# Altium project PCB_Project1.PrjPCB (part 1 of 3)
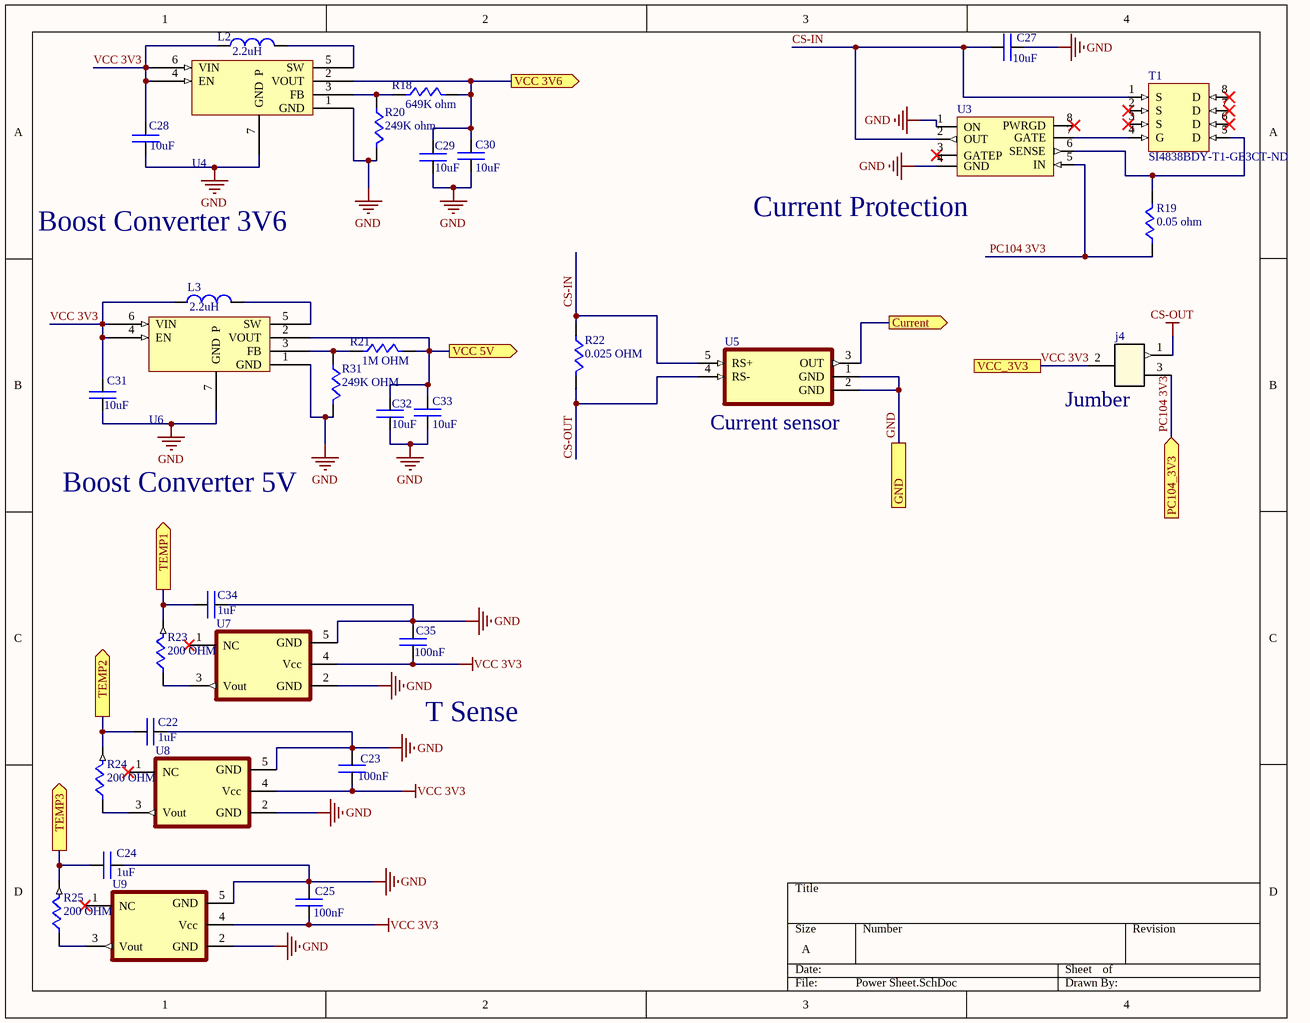
[diagram p0: Power Sheet.SchDoc]
2 sheets, 95 parts. Net scope: flat (ports and power ports of the same name join across sheets).
Board file: CommunicationBoard.PcbDoc
Sheets:
  Power Sheet.SchDoc
  Micro_Conection.SchDoc

## Sheet Power Sheet.SchDoc
size A

### Parts
C22  Capacitance: 1uF  [0805 C]  (hidden comment: CAP CER 1UF 16V X7R 0805)
C23  Capacitance: 100nF  [0805 C]  (hidden comment: CAP CER 0.1UF 10V 0805)
C24  Capacitance: 1uF  [0805 C]  (hidden comment: CAP CER 1UF 16V X7R 0805)
C25  Capacitance: 100nF  [0805 C]  (hidden comment: CAP CER 0.1UF 10V 0805)
C27  Capacitance: 10uF  [0805 C]  (hidden comment: CAP CER 10UF 10V X5R 0805)
C28  Capacitance: 10uF  [0805 C]  (hidden comment: CAP CER 10UF 10V X5R 0805)
C29  Capacitance: 10uF  [0805 C]  (hidden comment: CAP CER 10UF 10V X5R 0805)
C30  Capacitance: 10uF  [0805 C]  (hidden comment: CAP CER 10UF 10V X5R 0805)
C31  Capacitance: 10uF  [0805 C]  (hidden comment: CAP CER 10UF 10V X5R 0805)
C32  Capacitance: 10uF  [0805 C]  (hidden comment: CAP CER 10UF 10V X5R 0805)
C33  Capacitance: 10uF  [0805 C]  (hidden comment: CAP CER 10UF 10V X5R 0805)
C34  Capacitance: 1uF  [0805 C]  (hidden comment: CAP CER 1UF 16V X7R 0805)
C35  Capacitance: 100nF  [0805 C]  (hidden comment: CAP CER 0.1UF 10V 0805)
j4  CONN HEADER VERT 3POS 2.54MM  [jumber]  (value not drawn)
L2  Inductance: 2.2uH  [0805 L]  (hidden comment: FIXED IND 2.2UH 800MA 200 MOHM)
L3  Inductance: 2.2uH  [0805 L]  (hidden comment: FIXED IND 2.2UH 800MA 200 MOHM)
R18  649K ohm  [0805 R]
R19  0.05 ohm  [0805 R]
R20  249K ohm  [0805 R]
R21  1M OHM  [0805 R]
R22  0.025 OHM  [0805 R]
R23  200 OHM  [0805 R]
R24  200 OHM  [0805 R]
R25  200 OHM  [0805 R]
R31  249K OHM  [0805 R]
T1  Supplier Part Number 1: SI4838BDY-T1-GE3CT-ND  [Transistor_MOSFET]  (hidden comment: MOSFET N-CH 12V 34A 8-SOIC)
U3  IC OVERVOLTAGE/CUR PROT TSOT23-8  [current protection]  (value not drawn)
U4  IC REG BOOST 3.6V 800MA 6WSON  [Booster converter]  (value not drawn)
U5  IC CURR SENSE 1 CIRCUIT SOT23-5  [current sensor]  (value not drawn)
U6  IC REG BOOST 3.6V 800MA 6WSON  [Booster converter]  (value not drawn)
U7  SENSOR ANALOG -55C-130C SOT323-5  [temperture sensor]  (value not drawn)
U8  SENSOR ANALOG -55C-130C SOT323-5  [temperture sensor]  (value not drawn)
U9  SENSOR ANALOG -55C-130C SOT323-5  [temperture sensor]  (value not drawn)

### Ports
Current (out), GND, PC104_3V3 (in), TEMP1 (out), TEMP2 (out), TEMP3 (out), VCC 3V6 (out), VCC 5V (out), VCC_3V3

### Nets
CS-OUT: j4.1 R22.1 U5.4(RS-)
GND: C22.2 C23.1 C24.2 C25.1 C27.1 C28.2 C29.1 C30.1 C31.2 C32.1 C33.1 C34.2 C35.1 R20.1 R31.1 U3.1(ON) U3.4(GND) U4.1(GND) U4.7(GND__P) U5.1(GND) U5.2(GND) U6.1(GND) U6.7(GND__P) U7.2(GND) U7.5(GND) U8.2(GND) U8.5(GND) U9.2(GND) U9.5(GND) ; port GND
VCC 3V3: C23.2 C25.2 C28.1 C31.1 C35.2 j4.2 L2.2 L3.2 U4.4(EN) U4.6(VIN) U6.4(EN) U6.6(VIN) U7.4(Vcc) U8.4(Vcc) U9.4(Vcc) ; port VCC_3V3
CS-IN: C27.2 R22.2 T1.1(S) U3.2(OUT) U5.5(RS+)
PC104 3V3: j4.3 R19.2 U3.5(IN) ; port PC104_3V3
NetC22_1: C22.1 R24.1 ; port TEMP2
NetC24_1: C24.1 R25.1 ; port TEMP3
NetC29_2: C29.2 C30.2 R18.1 U4.2(VOUT) ; port VCC 3V6
NetC32_2: C32.2 C33.2 R21.1 U6.2(VOUT) ; port VCC 5V
NetC34_1: C34.1 R23.1 ; port TEMP1
NetL2_1: L2.1 U4.5(SW)
NetL3_1: L3.1 U6.5(SW)
NetR18_2: R18.2 R20.2 U4.3(FB)
NetR19_1: R19.1 T1.5(D) U3.6(SENSE)
NetR21_2: R21.2 R31.2 U6.3(FB)
NetR23_2: R23.2 U7.3(Vout)
NetR24_2: R24.2 U8.3(Vout)
NetR25_2: R25.2 U9.3(Vout)
NetT1_4: T1.4(G) U3.7(GATE)
NetU1_26: U5.3(OUT) ; port Current

Not connected (* = marked no-connect by the designer): T1 2(S)* 3(S)* 6(D)* 7(D)* 8(D)*; U3 3(GATEP)* 8(PWRGD)*; U7 1(NC)*; U8 1(NC)*; U9 1(NC)*

### Notes on the sheet
- Boost Converter 3V6
- (near U3) Current Protection
- (near U5) Current sensor
- (near j4) Jumber
- Boost Converter 5V
- T Sense

### Library data of the parts
C22 C24 C34 = C_1uF: 1µF ±5% 16V Ceramic Capacitor X7R 0805 (2012 Metric); Manufacturer: Murata; Manufacturer Part Number: GRM219R61H105KA73D; Tolerance: 10%; Voltage Rating: 50V; Dielectric: X5R; Dissipation Factor: 0.025%; Supplier 1: Digi-Key; RoHS: Yes; Stock 1: 54905; Pricing 1: 1 = 0.38000, 10 = 0.26100, 50 = 0.17420, 100 = 0.14810, 500 = 0.10454, 1000 = 0.09148 (USD); Mount: Surface Mount; Case/Package: 0805; Number of Pins: 2; Case Code (Metric): 2012; Case Code (Imperial): 0805; Material: Ceramic; Weight: 0.000335oz; Dielectric Material: Ceramic; Min Operating Temperature: -55°C; Max Operating Temperature: 85°C; Packaging: Tape and Reel; Voltage: 50V; Termination: SMD/SMT; Resistor Type: Ceramic; Voltage Rating (DC): 50V; Package Quantity: 4000; Length: 2mm; Width: 1.25mm; Height: 0.85mm; Thickness: 0.037inch; Depth: 1.25mm; REACH SVHC: No SVHC; Lead Free: Lead Free; ComponentLink1URL: http://www.farnell.com/datasheets/2746093.pdf?src-supplier=Farnell; ComponentLink1Description: http://www.farnell.com/datasheets/2746093.pdf?src-supplier=Farnell; Supplier Part Number 1: 399-8001-1-ND; Features: Soft Termination; Ratings: AEC-Q200; Radiation Hardening: No; Series: C; Construction: Flat; Lead Pitch: 0.75mm; RoHS Compliant: Yes
C23 C25 C35 = C_100nF: 0.1µF ±10% 16V Ceramic Capacitor X7R 0805 (2012 Metric); Manufacturer: Johanson; Manufacturer Part Number: 160R15W104KV4T; Supplier 1: Digi-Key; RoHS: Yes; Stock 1: 45779; Pricing 1: 1 = 0.21000, 10 = 0.14200, 50 = 0.08520, 100 = 0.07190, 500 = 0.04920, 1000 = 0.04352 (USD); Mount: Surface Mount; Case/Package: 0805; Case Code (Imperial): 0805; Case Code (Metric): 2012; Min Operating Temperature: -55°C; Max Operating Temperature: 125°C; Tolerance: 10%; Packaging: Tape and Reel; Voltage Rating: 16V; Dielectric: X7R; Termination: SMD/SMT; Voltage Rating (DC): 16V; Package Quantity: 1; Length: 0.08inch; Width: 0.05inch; Thickness: 0.05inch; ComponentLink1URL: https://www.johansondielectrics.com/downloads/catalog/johanson-dielectrics-product-catalog.pdf; ComponentLink1Description: https://www.johansondielectrics.com/downloads/catalog/johanson-dielectrics-product-catalog.pdf; Supplier Part Number 1: 709-1183-1-ND; Series: -; RoHS Compliant: Yes
C27-C33 = C_10uF: 10µF ±10% 10V Ceramic Capacitor X5R 0805 (2012 Metric); Manufacturer: TDK; Manufacturer Part Number: C2012X5R1C106K085AC; Voltage Rating: 16V; Supplier 1: Digi-Key; RoHS: Yes; Stock 1: 2246101; Pricing 1: 1 = 0.13000, 10 = 0.09100, 50 = 0.05160, 100 = 0.04270, 500 = 0.02992, 1000 = 0.02478 (USD); Mount: Surface Mount; Case/Package: 0805; Number of Pins: 2; Weight: 0.000194oz; Dielectric Material: Ceramic; Case Code (Metric): 2012; Case Code (Imperial): 0805; Min Operating Temperature: -55°C; Max Operating Temperature: 85°C; Tolerance: 10%; Packaging: Tape and Reel; Voltage Rating (DC): 16V; Package Quantity: 1; Termination: SMD/SMT; Resistor Type: Ceramic; Dielectric: X5R; Length: 2mm; Width: 0.049inch; Height: 0.85mm; Thickness: 0.037inch; Depth: 1.25mm; REACH SVHC: No SVHC; Lead Free: Lead Free; ComponentLink1URL: https://datasheet.ciiva.com/25730/cl21a106kpclqnc-25730594.pdf?src-supplier=Digi-Key; ComponentLink1Description: https://datasheet.ciiva.com/25730/cl21a106kpclqnc-25730594.pdf?src-supplier=Digi-Key; Supplier Part Number 1: 1276-2402-1-ND; Contact Plating: Tin; Series: CL; Construction: Flat; Radiation Hardening: No; RoHS Compliant: Yes
j4 = jumber: Connector Header Through Hole 3 position 0.100" (2.54mm); Manufacturer: Harwin; Manufacturer Part Number: M20-9990345; Contact Resistance: 25mR; Max Current Rating: 3A; Number of Positions: 3; Connector Type: Male Pin; Insulation Resistance: 10GR; Voltage Rating (AC): 750V; Gender: Male; Supplier 1: Digi-Key; Supplier Part Number 1: 732-5316-ND; RoHS: Yes; Mount: Through Hole; Case/Package: SIL; Contact Material: Brass,Bronze; Color: Black; Housing Color: Black; Housing Material: Nylon; Contact Plating: Gold; Weight: 0.006138oz; Min Operating Temperature: -40°C; Max Operating Temperature: 105°C; Number of Rows: 1; Package Quantity: 1000; Packaging: Bulk; Termination: Solder; Number of Contacts: 3; Orientation: Straight; Current Rating: 3A; Series: M20; Contact Type: Male Pin; Length: 7.62mm; Width: 0.25inch; Height: 0.125inch; Pitch: 2.54mm; Depth: 2.54mm; Contact Mating Length: 0.24inch; Radiation Hardening: No; REACH SVHC: No SVHC; RoHS Compliant: Yes; Stock 1: 36526; Pricing 1: 1 = 0.13000, 10 = 0.10600, 25 = 0.08800, 50 = 0.07400, 100 = 0.06700, 1000 = 0.06100 (USD); Lead Free: Lead Free; ComponentLink1URL: http://www.farnell.com/cad/1737268.pdf?src-supplier=Element14; ComponentLink1Description: http://www.farnell.com/cad/1737268.pdf?src-supplier=Element14; ComponentLink2URL: https://katalog.we-online.de/em/datasheet/6130xx11121.pdf?src-supplier=Digi-Key; ComponentLink2Description: https://katalog.we-online.de/em/datasheet/6130xx11121.pdf?src-supplier=Digi-Key
L2 L3 = L _2.2 uh: 2.2µH Shielded Multilayer Inductor 800mA 200mOhm Max 0805 (2012 Metric); Manufacturer: Taiyo Yuden; Manufacturer Part Number: BRC2012T2R2MD; Core Material: Ferrite; Max DC Current: 1A; DC Resistance (DCR): 143mR; Tolerance: 20%; Test Frequency: 1MHz; Self Resonant Frequency: 350MHz; Shielding: Unshielded; Saturation Current: 1.1A; RoHS: Yes; Mount: Surface Mount; Case/Package: 0805; Case Code (Imperial): 0805; Case Code (Metric): 2012; Min Operating Temperature: -40°C; Max Operating Temperature: 105°C; Termination: SMD/SMT; Resistor Type: Wirewound; DC Current: 1A; Packaging: Tape and Reel; Package Quantity: 2000; Current Rating: 1A; Length: 2mm; Height: 1.4mm; Depth: 1.45mm; Width: 0.049inch; Radiation Hardening: No; Military Standard: Not; Lead Free: Lead Free; Inductance Tolerance: 20%; Height - Seated (Max): 0.055inch; REACH SVHC: Unknown; Series: BRC; Supplier 1: Digi-Key; Stock 1: 117383; Pricing 1: 1 = 0.30000, 10 = 0.26800, 25 = 0.23440, 50 = 0.20100, 100 = 0.18420, 250 = 0.16752, 500 = 0.15744, 1000 = 0.12060 (USD); Supplier Part Number 1: 587-2905-1-ND; Number of Pins: 2; Lead Pitch: 1mm; Halogen Free: Halogen Free; RoHS Compliant: Yes; ComponentLink1URL: https://datasheet.ciiva.com/6748/brc2012t2r2md-ss-6748784.pdf?src-supplier=Newark; ComponentLink1Description: https://datasheet.ciiva.com/6748/brc2012t2r2md-ss-6748784.pdf?src-supplier=Newark; ComponentLink2URL: https://datasheet.ciiva.com/25607/0900766b810b3c54-25607837.pdf?src-supplier=RSComponents; ComponentLink2Description: https://datasheet.ciiva.com/25607/0900766b810b3c54-25607837.pdf?src-supplier=RSComponents; ComponentLink3URL: https://datasheet.ciiva.com/26870/getdatasheetpartid-639072-26870958.pdf?src-supplier=Verical; ComponentLink3Description: https://datasheet.ciiva.com/26870/getdatasheetpartid-639072-26870958.pdf?src-supplier=Verical; ComponentLink4URL: https://datasheet.ciiva.com/1042/wound07-e-1042306.pdf?src-supplier=Digi-Key; ComponentLink4Description: https://datasheet.ciiva.com/1042/wound07-e-1042306.pdf?src-supplier=Digi-Key; ComponentLink5URL: https://datasheet.ciiva.com/1042/wound07-e-1042307.pdf?src-supplier=Digi-Key; ComponentLink5Description: https://datasheet.ciiva.com/1042/wound07-e-1042307.pdf?src-supplier=Digi-Key; ComponentLink6URL: https://datasheet.ciiva.com/1042/wound07-e-1042308.pdf?src-supplier=Digi-Key; ComponentLink6Description: https://datasheet.ciiva.com/1042/wound07-e-1042308.pdf?src-supplier=Digi-Key
R18 = R_649k ohm: 649 kOhms ±0.5% 0.25W, 1/4W Chip Resistor 0805 (2012 Metric) Automotive AEC-Q200, Pulse Withstanding Thick Film; Manufacturer: Vishay; Manufacturer Part Number: CRCW08050000Z0EAC; Power Rating: 125mW; Resistance: 20R; Max Power Dissipation: 250mW; Temperature Coefficient: 50ppm/°C; RoHS: Yes; Mount: Surface Mount; Case/Package: Molded; Contact Plating: Tin; Min Operating Temperature: -55°C; Max Operating Temperature: 155°C; Resistor Type: Thick Film; Termination: Wraparound; Length: 2mm; Lead Free: Lead Free; ComponentLink1URL: http://www.vishay.com/docs/28773/crcwce3.pdf?src-supplier=Digi-Key; ComponentLink1Description: http://www.vishay.com/docs/28773/crcwce3.pdf?src-supplier=Digi-Key; Supplier 1: Digi-Key; Stock 1: 4016; Pricing 1: 1 = 0.23000, 10 = 0.19100, 25 = 0.13920, 50 = 0.10100, 100 = 0.07480, 250 = 0.05744, 500 = 0.04524, 1000 = 0.03132 (USD); Case Code (Imperial): 0805; Case Code (Metric): 2012; Tolerance: 0.5%; Packaging: Tape and Reel; Number of Terminations: 2; Features: Automotive AEC-Q200; Width: 0.049inch; Height - Seated (Max): 0.028inch; ComponentLink2URL: https://industrial.panasonic.com/sa/system/files/data/download/catalog/id_fixed-resistors_e_2.pdf?src-supplier=Digi-Key; ComponentLink2Description: https://industrial.panasonic.com/sa/system/files/data/download/catalog/id_fixed-resistors_e_2.pdf?src-supplier=Digi-Key; Supplier Part Number 1: P21340CT-ND
R19 = R_0.05ohm: 50 mOhms ±1% 0.5W, 1/2W Chip Resistor 0805 (2012 Metric) Automotive AEC-Q200, Current Sense Thick Film; Manufacturer: Vishay; Manufacturer Part Number: CRCW08050000Z0EAC; Power Rating: 125mW; Resistance: 20R; Temperature Coefficient: 100ppm/°C; RoHS: Yes; Mount: Surface Mount; Case/Package: Molded; Contact Plating: Tin; Min Operating Temperature: -55°C; Max Operating Temperature: 155°C; Resistor Type: Thick Film; Termination: Wraparound; Length: 2mm; Lead Free: Lead Free; ComponentLink1URL: http://www.mouser.com/ds/2/315/AOA0000C295-1109214.pdf?src-supplier=Mouser; ComponentLink1Description: http://www.mouser.com/ds/2/315/AOA0000C295-1109214.pdf?src-supplier=Mouser; Supplier 1: Digi-Key; Stock 1: 4506; Pricing 1: 1 = 0.58000, 10 = 0.42500, 100 = 0.24750, 1000 = 0.13880, 2500 = 0.13600 (USD); Number of Pins: 2; Case Code (Metric): 2012; Case Code (Imperial): 0805; Weight: 0.000194oz; Tolerance: 1%; Packaging: Tape and Reel; Package Quantity: 5000; Number of Terminations: 2; Max Power Dissipation: 125mW; Width: 0.049inch; Height: 0.6mm; Depth: 1.25mm; Radiation Hardening: No; REACH SVHC: No SVHC; Military Standard: Not; ComponentLink2URL: http://www.farnell.com/datasheets/2244535.pdf?src-supplier=Farnell; ComponentLink2Description: http://www.farnell.com/datasheets/2244535.pdf?src-supplier=Farnell; ComponentLink3URL: https://industrial.panasonic.com/cdbs/www-data/pdf/RDN0000/AOA0000C313.pdf?src-supplier=Digi-Key; ComponentLink3Description: https://industrial.panasonic.com/cdbs/www-data/pdf/RDN0000/AOA0000C313.pdf?src-supplier=Digi-Key; ComponentLink4URL: http://www.farnell.com/datasheets/2244535.pdf?src-supplier=Newark; ComponentLink4Description: http://www.farnell.com/datasheets/2244535.pdf?src-supplier=Newark; ComponentLink5URL: http://www.farnell.com/datasheets/1951809.pdf?src-supplier=Element14; ComponentLink5Description: http://www.farnell.com/datasheets/1951809.pdf?src-supplier=Element14; Supplier Part Number 1: P17581CT-ND; Features: Automotive AEC-Q200
R20 R31 = R_249 kohm: 249 kOhms ±1% 0.5W, 1/2W Chip Resistor 0805 (2012 Metric) Automotive AEC-Q200, Pulse Withstanding Thick Film; Manufacturer: Vishay Dale; Manufacturer Part Number: CRCW0805249KFKEAHP; Power Rating: 330mW; Resistance: 249kR; Max Power Dissipation: 500mW; Temperature Coefficient: 100ppm/°C; RoHS: Yes; Mount: Surface Mount; Case/Package: 0805; Contact Plating: Tin; Min Operating Temperature: -55°C; Max Operating Temperature: 155°C; Resistor Type: Thick Film; Termination: Wraparound; Length: 0.079inch; Lead Free: Lead Free; ComponentLink1URL: http://www.vishay.com/docs/28773/crcwce3.pdf?src-supplier=Digi-Key; ComponentLink1Description: http://www.vishay.com/docs/28773/crcwce3.pdf?src-supplier=Digi-Key; Supplier 1: Digi-Key; Stock 1: 4200; Pricing 1: 1 = 0.23000, 10 = 0.19200, 100 = 0.07520, 1000 = 0.03150, 2500 = 0.02888 (USD); Package Quantity: 5000; Tolerance: 1%; Packaging: Tape and Reel; Number of Terminations: 2; Features: Automotive AEC-Q200; Series: CRCW-HP; Width: 0.049inch; Height: 0.024inch; RoHS Compliant: Yes; ComponentLink2URL: https://datasheet.ciiva.com/2581/crcwhpe3-2581775.pdf?src-supplier=Digi-Key; ComponentLink2Description: https://datasheet.ciiva.com/2581/crcwhpe3-2581775.pdf?src-supplier=Digi-Key; Supplier Part Number 1: 541-CRCW0805249KFKEAHPCT-ND
R21 = R_1 Mohm: 1 MOhms ±1% 0.5W, 1/2W Chip Resistor 0805 (2012 Metric) Automotive AEC-Q200, Pulse Withstanding Thick Film; Manufacturer: Vishay; Manufacturer Part Number: CRCW08050000Z0EAC; Power Rating: 125mW; Resistance: 20R; Voltage Rating: 150V; Max Power Dissipation: 333mW; Temperature Coefficient: 100ppm/°C; RoHS: Yes; Mount: Surface Mount; Case/Package: Molded; Contact Plating: Tin; Min Operating Temperature: -55°C; Max Operating Temperature: 155°C; Resistor Type: Thick Film; Termination: Wraparound; Length: 2mm; Lead Free: Lead Free; ComponentLink1URL: http://www.vishay.com/docs/28773/crcwce3.pdf?src-supplier=Digi-Key; ComponentLink1Description: http://www.vishay.com/docs/28773/crcwce3.pdf?src-supplier=Digi-Key; Supplier 1: Digi-Key; Stock 1: 21204; Pricing 1: 1 = 0.23000, 10 = 0.19300, 100 = 0.07530, 1000 = 0.03150, 2500 = 0.02888 (USD); Weight: 0.000194oz; Case Code (Metric): 2012; Case Code (Imperial): 0805; Package Quantity: 10; Tolerance: 1%; Packaging: Tape and Reel; Number of Terminations: 2; Features: Automotive AEC-Q200; Series: CRCW-HP; Width: 0.049inch; Height: 0.024inch; Radiation Hardening: No; RoHS Compliant: Yes; ComponentLink2URL: https://datasheet.ciiva.com/2475/crcwhpe3-2475641.pdf?src-supplier=Digi-Key; ComponentLink2Description: https://datasheet.ciiva.com/2475/crcwhpe3-2475641.pdf?src-supplier=Digi-Key; ComponentLink3URL: https://datasheet.ciiva.com/2475/crcwhpe3-2475642.pdf?src-supplier=Digi-Key; ComponentLink3Description: https://datasheet.ciiva.com/2475/crcwhpe3-2475642.pdf?src-supplier=Digi-Key; ComponentLink4URL: https://datasheet.ciiva.com/2475/crcwhpe3-2475643.pdf?src-supplier=Digi-Key; ComponentLink4Description: https://datasheet.ciiva.com/2475/crcwhpe3-2475643.pdf?src-supplier=Digi-Key; ComponentLink5URL: https://datasheet.ciiva.com/48527/crcwhpe3-48527597.pdf?src-supplier=Avnet; ComponentLink5Description: https://datasheet.ciiva.com/48527/crcwhpe3-48527597.pdf?src-supplier=Avnet; ComponentLink6URL: https://datasheet.ciiva.com/5545/crcwhpe3-46056-5545486.pdf?src-supplier=Mouser; ComponentLink6Description: https://datasheet.ciiva.com/5545/crcwhpe3-46056-5545486.pdf?src-supplier=Mouser; ComponentLink7URL: https://datasheet.ciiva.com/9112/crcwhpe3-9112399.pdf?src-supplier=Avnet; ComponentLink7Description: https://datasheet.ciiva.com/9112/crcwhpe3-9112399.pdf?src-supplier=Avnet; Supplier Part Number 1: 541-1.00MTCT-ND
R22 = R_0.025ohm: 25 mOhms ±1% 0.5W, 1/2W Chip Resistor 0805 (2012 Metric) Automotive AEC-Q200, Current Sense Thick Film; Manufacturer: Vishay; Manufacturer Part Number: CRCW08050000Z0EAC; RoHS: Yes; Mount: Surface Mount; Case/Package: Molded; ComponentLink1URL: http://www.mouser.com/ds/2/315/AOA0000C295-1109214.pdf?src-supplier=Mouser; ComponentLink1Description: http://www.mouser.com/ds/2/315/AOA0000C295-1109214.pdf?src-supplier=Mouser; ComponentLink2URL: http://www.farnell.com/datasheets/2244535.pdf?src-supplier=Farnell; ComponentLink2Description: http://www.farnell.com/datasheets/2244535.pdf?src-supplier=Farnell; ComponentLink3URL: https://industrial.panasonic.com/cdbs/www-data/pdf/RDN0000/AOA0000C313.pdf?src-supplier=Digi-Key; ComponentLink3Description: https://industrial.panasonic.com/cdbs/www-data/pdf/RDN0000/AOA0000C313.pdf?src-supplier=Digi-Key; ComponentLink4URL: http://www.farnell.com/datasheets/2244535.pdf?src-supplier=Newark; ComponentLink4Description: http://www.farnell.com/datasheets/2244535.pdf?src-supplier=Newark; ComponentLink5URL: http://www.farnell.com/datasheets/1951809.pdf?src-supplier=Element14; ComponentLink5Description: http://www.farnell.com/datasheets/1951809.pdf?src-supplier=Element14; Supplier 1: Future Electronics; Supplier Part Number 1: 6091549
R23-R25 = R_200 ohm: 200 Ohms ±0.1% 0.125W, 1/8W Chip Resistor 0805 (2012 Metric) Automotive AEC-Q200 Thin Film; Manufacturer: Panasonic; Manufacturer Part Number: ERJ-P06F2000V; Temperature Coefficient: 100ppm/°C; Voltage Rating (DC): 150V; Resistance: 200R; Power Rating: 500mW; Tolerance: 1%; Supplier 1: Digi-Key; RoHS: Yes; Stock 1: 15886; Pricing 1: 1 = 0.31000, 10 = 0.26200, 100 = 0.10230, 1000 = 0.04284, 2500 = 0.03927 (USD); Mount: Surface Mount; Case/Package: 0805; Number of Pins: 2; Case Code (Imperial): 0805; Case Code (Metric): 2012; Contact Plating: Tin; Min Operating Temperature: -55°C; Max Operating Temperature: 155°C; Resistor Type: Thick Film; Voltage Rating: 150V; Packaging: Tape and Reel; Package Quantity: 5000; Termination: Wraparound; Length: 2mm; Width: 1.2mm; Height: 0.6mm; Depth: 1.25mm; Lead Free: Lead Free; Military Standard: Not; REACH SVHC: No SVHC; ComponentLink1URL: https://datasheet.ciiva.com/11811/0900766b812cb812-11811594.pdf?src-supplier=RSComponents; ComponentLink1Description: https://datasheet.ciiva.com/11811/0900766b812cb812-11811594.pdf?src-supplier=RSComponents; ComponentLink2URL: https://datasheet.ciiva.com/24026/aoa0000ce4-64075-24026537.pdf?src-supplier=Mouser; ComponentLink2Description: https://datasheet.ciiva.com/24026/aoa0000ce4-64075-24026537.pdf?src-supplier=Mouser; ComponentLink3URL: https://datasheet.ciiva.com/9184/aoa0000ce4-9184694.pdf?src-supplier=Avnet; ComponentLink3Description: https://datasheet.ciiva.com/9184/aoa0000ce4-9184694.pdf?src-supplier=Avnet; ComponentLink4URL: https://datasheet.ciiva.com/30051/aoa0000ce4-30051223.pdf?src-supplier=Onlinecomponents.com; ComponentLink4Description: https://datasheet.ciiva.com/30051/aoa0000ce4-30051223.pdf?src-supplier=Onlinecomponents.com; ComponentLink5URL: https://datasheet.ciiva.com/29184/452790-da-01-en-widerstand-0805-era-29184068.pdf?src-supplier=Conrad; ComponentLink5Description: https://datasheet.ciiva.com/29184/452790-da-01-en-widerstand-0805-era-29184068.pdf?src-supplier=Conrad; Supplier Part Number 1: P200DACT-ND; Number of Terminations: 2; Max Power Dissipation: 500mW; Features: Automotive AEC-Q200; Series: ERJ; Construction: Rectangular; Technology: THICK FILM; Radiation Hardening: No; RoHS Compliant: Yes; Size Code: 0805; Resistance Tolerance: 0.1%; ComponentLink6URL: https://datasheet.ciiva.com/16769/70068849-16769175.pdf?src-supplier=Allied+Electronics; ComponentLink6Description: https://datasheet.ciiva.com/16769/70068849-16769175.pdf?src-supplier=Allied+Electronics; ComponentLink7URL: https://datasheet.ciiva.com/43457/485442-43457863.pdf?src-supplier=Farnell; ComponentLink7Description: https://datasheet.ciiva.com/43457/485442-43457863.pdf?src-supplier=Farnell; ComponentLink8URL: https://datasheet.ciiva.com/9184/aoa0000ce26-9184632.pdf?src-supplier=Avnet; ComponentLink8Description: https://datasheet.ciiva.com/9184/aoa0000ce26-9184632.pdf?src-supplier=Avnet; ComponentLink9URL: https://datasheet.ciiva.com/30158/54aoa0000ce26-30158504.pdf?src-supplier=Onlinecomponents.com; ComponentLink9Description: https://datasheet.ciiva.com/30158/54aoa0000ce26-30158504.pdf?src-supplier=Onlinecomponents.com; ComponentLink10URL: https://datasheet.ciiva.com/48425/era-eng-tds-48425774.pdf?src-supplier=Distrelec; ComponentLink10Description: https://datasheet.ciiva.com/48425/era-eng-tds-48425774.pdf?src-supplier=Distrelec; ComponentLink11URL: https://datasheet.ciiva.com/16781/70068849-16781071.pdf?src-supplier=Allied+Electronics; ComponentLink11Description: https://datasheet.ciiva.com/16781/70068849-16781071.pdf?src-supplier=Allied+Electronics; ComponentLink12URL: https://datasheet.ciiva.com/17207/aoa0000ce26-17207007.pdf?src-supplier=Avnet+Europe; ComponentLink12Description: https://datasheet.ciiva.com/17207/aoa0000ce26-17207007.pdf?src-supplier=Avnet+Europe
T1 = Transistor_MOSFET: N-Channel 12V 34A (Tc) 2.5W (Ta), 5.7W (Tc) Surface Mount 8-SO; Manufacturer: Vishay Siliconix; Manufacturer Part Number: SI4838BDY-T1-GE3; Rds On Max: 2.7mR; Input Capacitance: 5.76nF; Rise Time: 92ns; Nominal Vgs: 400mV; Gate to Source Voltage (Vgs): 8V; Fall Time: 19ns; Turn-Off Delay Time: 34ns; Number of Elements: 1; Element Configuration: Single; Turn-On Delay Time: 48ns; ComponentLink1Description: Datta sheet; ComponentLink1URL: https://www.vishay.com/docs/68964/si4838bd.pdf; ComponentLink2Description: https://www.digikey.com/en/products/detail/vishay-siliconix/SI4838BDY-T1-GE3/2441666?s=N4IgTCBcDaIM4EsAsAOAzCgRgEwJ4FoAXARnwHMBTNEAXQF8g; ComponentLink2URL: https://www.digikey.com/en/products/detail/vishay-siliconix/SI4838BDY-T1-GE3/2441666?s=N4IgTCBcDaIM4EsAsAOAzCgRgEwJ4FoAXARnwHMBTNEAXQF8g; Supplier 1: Digi-Key; RoHS: Yes; Stock 1: 2068; Pricing 1: 1 = 1.64000, 10 = 1.34500, 25 = 1.32040, 100 = 1.04620, 500 = 0.88680, 1000 = 0.72239 (USD); Mount: Surface Mount; Case/Package: SOIC; Number of Pins: 8; Weight: 0.01787oz; Min Operating Temperature: -55°C; Max Operating Temperature: 150°C; Packaging: Tape and Reel; Package Quantity: 1; Drain to Source Voltage (Vdss): 12V; Continuous Drain Current (ID): 34A; Max Power Dissipation: 5.7W; Drain to Source Breakdown Voltage: 12V; Drain to Source Resistance: 2.7mR; Threshold Voltage: 400mV; Power Dissipation: 2.5W; Number of Channels: 1; On-State Resistance: 2.7mR; Polarity: N-CHANNEL; Series: TrenchFET®; Drain-source On Resistance-Max: 2.7mR; Length: 5mm; Width: 4mm; Height: 1.5mm; Radiation Hardening: No; REACH SVHC: Unknown; Lead Free: Lead Free; RoHS Compliant: Yes; ComponentLink3URL: https://datasheet.ciiva.com/26137/si4838bd-26137041.pdf?src-supplier=Avnet+Europe; ComponentLink3Description: https://datasheet.ciiva.com/26137/si4838bd-26137041.pdf?src-supplier=Avnet+Europe; ComponentLink4URL: https://datasheet.ciiva.com/23856/1719793-23856870.pdf?src-supplier=Newark; ComponentLink4Description: https://datasheet.ciiva.com/23856/1719793-23856870.pdf?src-supplier=Newark; ComponentLink5URL: https://datasheet.ciiva.com/4442/si4838bd-244494-4442712.pdf?src-supplier=Mouser; ComponentLink5Description: https://datasheet.ciiva.com/4442/si4838bd-244494-4442712.pdf?src-supplier=Mouser; ComponentLink6URL: https://datasheet.ciiva.com/26790/si4838bdy-t1-ge3-26790470.pdf?src-supplier=IIIC; ComponentLink6Description: https://datasheet.ciiva.com/26790/si4838bdy-t1-ge3-26790470.pdf?src-supplier=IIIC; ComponentLink7URL: https://datasheet.ciiva.com/943/si4838bd-943924.pdf?src-supplier=Digi-Key; ComponentLink7Description: https://datasheet.ciiva.com/943/si4838bd-943924.pdf?src-supplier=Digi-Key; ComponentLink8URL: https://datasheet.ciiva.com/6386/si4838bd-6386826.pdf?src-supplier=Digi-Key; ComponentLink8Description: https://datasheet.ciiva.com/6386/si4838bd-6386826.pdf?src-supplier=Digi-Key; ComponentLink9URL: https://datasheet.ciiva.com/22652/1719793-22652347.pdf?src-supplier=Element14; ComponentLink9Description: https://datasheet.ciiva.com/22652/1719793-22652347.pdf?src-supplier=Element14; ComponentLink10URL: https://datasheet.ciiva.com/6386/si4838bd-6386828.pdf?src-supplier=Digi-Key; ComponentLink10Description: https://datasheet.ciiva.com/6386/si4838bd-6386828.pdf?src-supplier=Digi-Key; ComponentLink11URL: https://datasheet.ciiva.com/11160/si4838bd-11160527.pdf?src-supplier=Avnet; ComponentLink11Description: https://datasheet.ciiva.com/11160/si4838bd-11160527.pdf?src-supplier=Avnet
U3 = current protection: Handheld/Mobile Devices PMIC TSOT-23-8; Supplier 1: Arrow Electronics; Supplier Part Number 1: LTC4361ITS8-1#TRMPBF; ComponentLink1Description: https://www.digikey.com/en/products/detail/analog-devices-inc/LTC4361CTS8-1-TRMPBF/2297144; ComponentLink1URL: https://www.digikey.com/en/products/detail/analog-devices-inc/LTC4361CTS8-1-TRMPBF/2297144; ComponentLink2Description: data sheet; ComponentLink2URL: https://www.analog.com/media/en/technical-documentation/data-sheets/LTC4361-1-4361-2.pdf
U4 U6 = Boost converter: Boost Switching Regulator IC Positive Fixed 3.6V 1 Output 800mA (Switch) 6-WDFN Exposed Pad; Supplier 1: Digi-Key; ComponentLink1Description: https://www.digikey.com/en/products/detail/texas-instruments/TPS610995DRVR/9343366; ComponentLink1URL: https://www.digikey.com/en/products/detail/texas-instruments/TPS610995DRVR/9343366; Supplier Part Number 1: 296-50423-2-ND; ComponentLink2Description: data sheet; ComponentLink2URL: https://www.ti.com/general/docs/suppproductinfo.tsp?distId=10&gotoUrl=http%3A%2F%2Fwww.ti.com%2Flit%2Fgpn%2Ftps61099
U5 = current sensor: Current Sense Amplifier 1 Circuit  SOT-23-5; Manufacturer: Maxim; MP: MAX9938FEUK+T; MF: Maxim Integrated; Max Power Dissipation: 312mW; Nominal Supply Current: 1uA; Output Voltage: 200mV; Common Mode Rejection Ratio: 130dB; Max Supply Voltage: 28V; Min Supply Voltage: 1.6V; Bandwidth: 125kHz; -3db Bandwidth: 60kHz; Number of Circuits: 1; Input Offset Voltage (Vos): 500uV; Operating Supply Current: 1.1uA; Input Bias Current: 200nA; Purchase-URL: https://pricing.snapeda.com/search/part/MAX9938FEUK+T/?ref=eda; Price: None; Availability: Warning; SnapEDA_Link: https://www.snapeda.com/parts/MAX9938FEUK+T/Maxim%20Integrated/view-part/559558/?ref=snap; Check_prices: https://www.snapeda.com/parts/MAX9938FEUK+T/Maxim%20Integrated/view-part/559558/?ref=eda; Value: *; Package: SOT-5 Maxim; Supplier 1: Digi-Key; Manufacturer Part Number: MAX9938FEUK+T; RoHS: Yes; Stock 1: 2603; Pricing 1: 1 = 1.74000, 10 = 1.56400, 25 = 1.47520, 100 = 1.23900 (USD); Case/Package: SOT-23-5; Number of Pins: 5; Min Operating Temperature: -40°C; Max Operating Temperature: 85°C; Packaging: Cut Tape; Package Quantity: 1; Number of Amplifiers: 1; Gain Bandwidth Product: 125kHz; Radiation Hardening: No; REACH SVHC: Unknown; ComponentLink6URL: https://datasheet.ciiva.com/1485/max9938-1485035.pdf?src-supplier=Element14; ComponentLink6Description: https://datasheet.ciiva.com/1485/max9938-1485035.pdf?src-supplier=Element14; Supplier Part Number 1: MAX9938HEUK+TCT-ND; Contact Plating: Tin,Matte
U7-U9 = Temperature sensor: Temperature Sensor Analog, Local -55°C ~ 130°C 11.77mV/°C SOT-323-5; Manufacturer: Texas Instruments; Manufacturer Part Number: TPS79933QDDCRQ1; MP: MAX9938FEUK+T; MF: Maxim Integrated; Number of Outputs: 1; Output Voltage: 3.3V; Max Power Dissipation: 500mW; Dropout Voltage: 90mV; Output Current: 200mA; Max Input Voltage: 6.5V; Min Input Voltage: 2.7V; Polarity: Positive; Accuracy: 2%; Output Voltage Accuracy: 1%; Quiescent Current: 40uA; Output Type: Fixed; Min Supply Voltage: 2.4V; Max Supply Voltage: 5.5V; Nominal Supply Current: 8uA; Purchase-URL: https://pricing.snapeda.com/search/part/MAX9938FEUK+T/?ref=eda; Price: None; Availability: Warning; SnapEDA_Link: https://www.snapeda.com/parts/MAX9938FEUK+T/Maxim%20Integrated/view-part/559558/?ref=snap; Check_prices: https://www.snapeda.com/parts/MAX9938FEUK+T/Maxim%20Integrated/view-part/559558/?ref=eda; Value: *; Package: SOT-5 Maxim; Supplier 1: Digi-Key; RoHS: Yes; Stock 1: 34551; Pricing 1: 1 = 0.83000, 10 = 0.72900, 25 = 0.68520, 100 = 0.55910, 500 = 0.44200, 1000 = 0.35360 (USD); Case/Package: TSOT; Number of Pins: 5; Contact Plating: Gold; Min Operating Temperature: -40°C; Max Operating Temperature: 125°C; Packaging: Tape and Reel; Package Quantity: 1; Max Output Current: 200mA; Number of Regulators: 1; Min Current Limit: 200mA; Nominal Output Voltage: 3.3V; Power Dissipation: 500mW; Min Output Voltage: 3.3V; Max Output Voltage: 3.3V; Radiation Hardening: No; REACH SVHC: No SVHC; Lead Free: Lead Free; ComponentLink1URL: https://datasheet.ciiva.com/1514/1455553-1514032.pdf?src-supplier=Element14; ComponentLink1Description: https://datasheet.ciiva.com/1514/1455553-1514032.pdf?src-supplier=Element14; ComponentLink2URL: https://datasheet.ciiva.com/16635/cd00119601-16635456.pdf?src-supplier=Avnet+Europe; ComponentLink2Description: https://datasheet.ciiva.com/16635/cd00119601-16635456.pdf?src-supplier=Avnet+Europe; ComponentLink3URL: https://datasheet.ciiva.com/15098/getdatasheetpartid-50614-15098126.pdf?src-supplier=Verical; ComponentLink3Description: https://datasheet.ciiva.com/15098/getdatasheetpartid-50614-15098126.pdf?src-supplier=Verical; Supplier Part Number 1: 497-5970-1-ND; Mount: Surface Mount; Max Supply Voltage (DC): 5.5V; Min Supply Voltage (DC): 2.4V; Operating Supply Current: 8uA; Termination: SMD/SMT; Series: STLM20; Supply Current: 8uA; Length: 2.2mm; Width: 1.35mm; Height: 1mm; RoHS Compliant: Yes; ComponentLink4URL: https://datasheet.ciiva.com/2847/cd00119601-2847248.pdf?src-supplier=Digi-Key; ComponentLink4Description: https://datasheet.ciiva.com/2847/cd00119601-2847248.pdf?src-supplier=Digi-Key; ComponentLink5URL: https://datasheet.ciiva.com/2847/cd00119601-2847249.pdf?src-supplier=Digi-Key; ComponentLink5Description: https://datasheet.ciiva.com/2847/cd00119601-2847249.pdf?src-supplier=Digi-Key

## Sheet Micro_Conection.SchDoc
size A
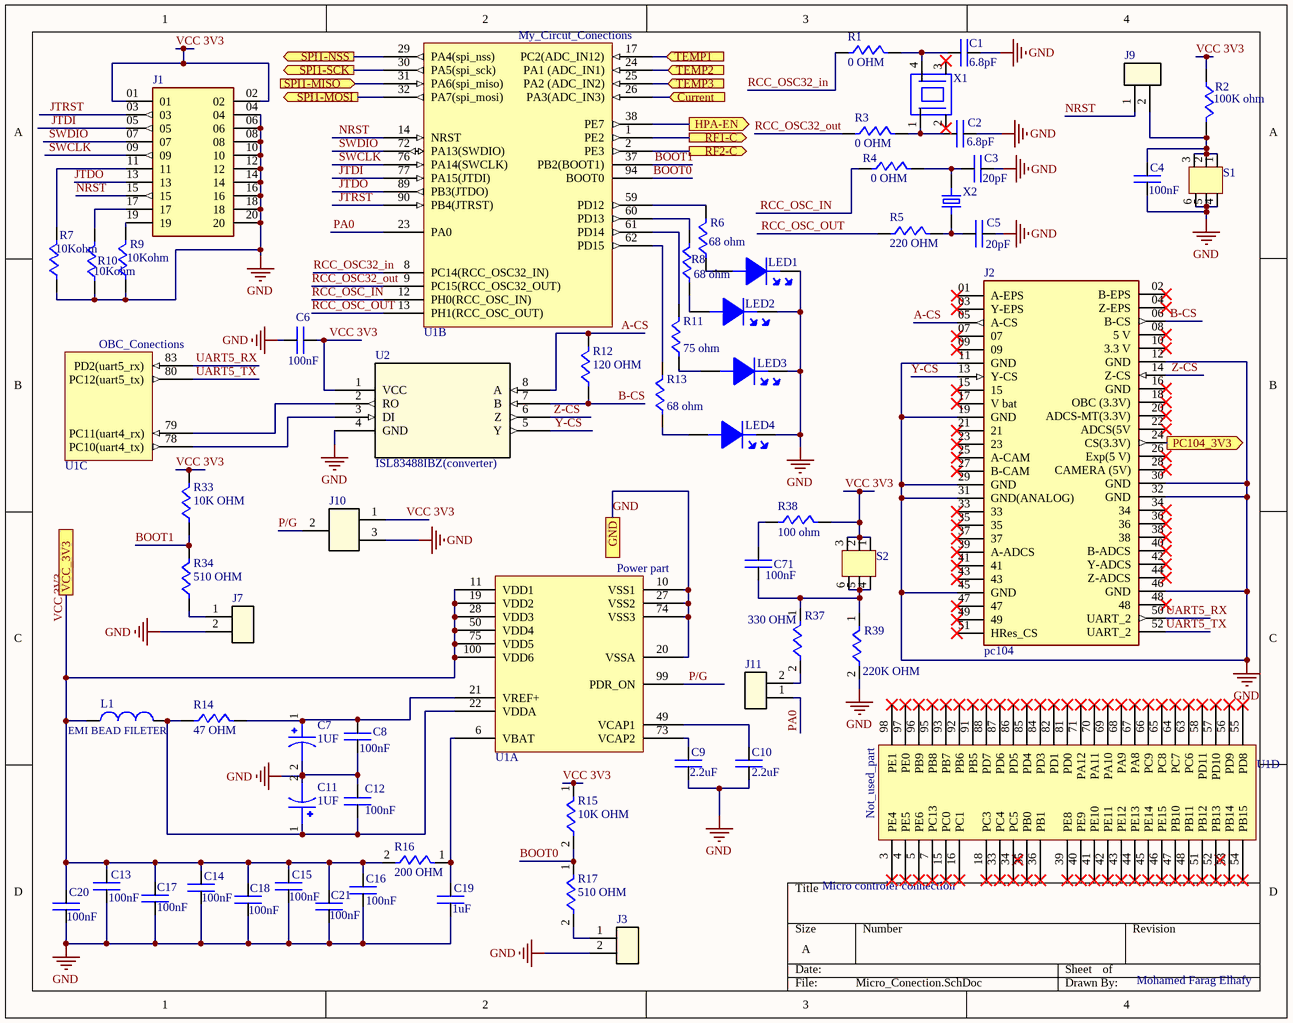
[diagram p1: Micro_Conection.SchDoc]

### Parts
C1  Capacitance: 6.8pF  [0805 C]  (hidden comment: CAP CER 6.8PF 100V NPO 0805)
C2  Capacitance: 6.8pF  [0805 C]  (hidden comment: CAP CER 6.8PF 100V NPO 0805)
C3  Capacitance: 20pF  [0805 C]  (hidden comment: CAP CER 20PF 25V NP0 0603)
C4  Capacitance: 100nF  [0805 C]  (hidden comment: CAP CER 0.1UF 10V 0805)
C5  Capacitance: 20pF  [0805 C]  (hidden comment: CAP CER 20PF 25V NP0 0603)
C6  Capacitance: 100nF  [0805 C]  (hidden comment: CAP CER 0.1UF 10V 0805)
C7  1UF  [1206 C]
C8  Capacitance: 100nF  [0805 C]  (hidden comment: CAP CER 0.1UF 10V 0805)
C9  Capacitance: 2.2uF  [0805 C]  (hidden comment: CAP CER 2.2UF 25V X7R 0805)
C10  Capacitance: 2.2uF  [0805 C]  (hidden comment: CAP CER 2.2UF 25V X7R 0805)
C11  1UF  [1206 C]
C12  Capacitance: 100nF  [0805 C]  (hidden comment: CAP CER 0.1UF 10V 0805)
C13  Capacitance: 100nF  [0805 C]  (hidden comment: CAP CER 0.1UF 10V 0805)
C14  Capacitance: 100nF  [0805 C]  (hidden comment: CAP CER 0.1UF 10V 0805)
C15  Capacitance: 100nF  [0805 C]  (hidden comment: CAP CER 0.1UF 10V 0805)
C16  Capacitance: 100nF  [0805 C]  (hidden comment: CAP CER 0.1UF 10V 0805)
C17  Capacitance: 100nF  [0805 C]  (hidden comment: CAP CER 0.1UF 10V 0805)
C18  Capacitance: 100nF  [0805 C]  (hidden comment: CAP CER 0.1UF 10V 0805)
C19  Capacitance: 1uF  [0805 C]  (hidden comment: CAP CER 1UF 16V X7R 0805)
C20  Capacitance: 100nF  [0805 C]  (hidden comment: CAP CER 0.1UF 10V 0805)
C21  Capacitance: 100nF  [0805 C]  (hidden comment: CAP CER 0.1UF 10V 0805)
C71  Capacitance: 100nF  [0805 C]  (hidden comment: CAP CER 0.1UF 10V 0805)
J1  CONN HEADER VERT 20POS 2.54MM  [JTAG]  (value not drawn)
J2  pc104  [pc104]
J3  CONN HEADER VERT 2POS 2.54MM  [jumber 2]  (value not drawn)
J7  CONN HEADER VERT 2POS 2.54MM  [jumber 2]  (value not drawn)
J9  CONN HEADER VERT 2POS 2.54MM  [jumber 2]  (value not drawn)
J10  CONN HEADER VERT 3POS 2.54MM  [jumber]  (value not drawn)
J11  CONN HEADER VERT 2POS 2.54MM  [jumber 2]  (value not drawn)
L1  EMI BEAD FILETER  [0805 C]
LED1  LED GREEN CLEAR CHIP SMD R/A  [LED]  (value not drawn)
LED2  LED ORANGE CLEAR SMD  [LED]  (value not drawn)
LED3  LED RED CLEAR SMD  [LED]  (value not drawn)
LED4  LED YELLOW CLEAR SMD  [LED]  (value not drawn)
R1  0 OHM  [0805 R]
R2  100K ohm  [0805 R]
R3  0 OHM  [0805 R]
R4  0 OHM  [0805 R]
R5  220 OHM  [0805 R]
R6  Resistance: 68 ohm  [0805 R]  (hidden comment: RES 68 OHM 5% 1/4W 0805)
R7  10Kohm  [0805 R]
R8  Resistance: 68 ohm  [0805 R]  (hidden comment: RES 68 OHM 5% 1/4W 0805)
R9  10Kohm  [0805 R]
R10  10Kohm  [0805 R]
R11  Resistance: 75 ohm  [0805 R]  (hidden comment: RES 75 OHM 1% 1/4W 0805)
R12  120 OHM  [0805 R]
R13  Resistance: 68 ohm  [0805 R]  (hidden comment: RES 68 OHM 5% 1/4W 0805)
R14  47 OHM  [0805 R]
R15  10K OHM  [0805 R]
R16  200 OHM  [0805 R]
R17  510 OHM  [0805 R]
R33  10K OHM  [0805 R]
R34  510 OHM  [0805 R]
R37  330 OHM  [0805 R]
R38  Resistance: 100 ohm  [0805 R]  (hidden comment: RES SMD 100 OHM 5% 1/2W 0805)
R39  220K OHM  [0805 R]
S1  Pushbutton Switches 2 Poles Vertical  [push button]  (value not drawn)
S2  Pushbutton Switches 2 Poles Vertical  [push button]  (value not drawn)
U1  STM32F407VGT6_1  [STM32F407VGT6 P]  (value not drawn)  (parts A,B,C,D of 4)
U2  ISL83488IBZ(converter)  [ISL83488IBZ]
X1  MC-146 32.7680KA-E3: ROHS  [CRYSTAL 32K]  (value not drawn)
X2  CRYSTAL 8.0000MHZ 32PF SMD  [XTAL_ECS-80-32-5PX-TR]  (value not drawn)

### Ports
Current (in), GND, HPA-EN (out), PC104_3V3 (out), RF1-C (out), RF2-C (out), SPI1-MISO (in), SPI1-MOSI (out), SPI1-NSS (out), SPI1-SCK (out), TEMP1 (in), TEMP2 (in), TEMP3 (in), VCC_3V3

### Nets
GND: C1.1 C2.1 C3.1 C4.2 C5.1 C6.1 C7.2 C8.2 C9.2 C10.2 C11.2 C12.1 C13.2 C14.2 C15.2 C16.2 C17.2 C18.2 C19.2 C20.2 C21.2 J1.04 J1.06 J1.08 J1.10 J1.12 J1.14 J1.16 J1.18 J1.20 J2.11(GND) J2.12(GND) J2.19(GND) J2.29(GND) J2.30(GND) J2.31(GND(ANALOG)) J2.32(GND) J2.45(GND) J2.46(GND) J3.2 J7.2 J10.3 LED1.2 LED2.2 LED3.2 LED4.2 R7.2 R9.2 R10.2 R39.2 S1.4 S1.5 S1.6 U1.10(VSS1) U1.20(VSSA) U1.27(VSS2) U1.74(VSS3) U2.4(GND) ; port GND
VCC 3V3: C6.2 C13.1 C14.1 C15.1 C16.1 C17.1 C18.1 C20.1 C21.1 J1.01 J1.02 J10.1 L1.2 R2.2 R15.1 R16.2 R33.1 R38.1 S2.1 S2.2 S2.3 U1.11(VDD1) U1.19(VDD2) U1.28(VDD3) U1.50(VDD4) U1.75(VDD5) U1.100(VDD6) U2.1(VCC) ; port VCC_3V3
A-CS: J2.05(A-CS) R12.1 U2.8(A)
B-CS: J2.06(B-CS) R12.2 U2.7(B)
BOOT0: R15.2 R17.1 U1.94(BOOT0)
BOOT1: R33.2 R34.1 U1.37(PB2(BOOT1))
JTDI: J1.05 U1.77(PA15(JTDI))
JTDO: J1.13 U1.89(PB3(JTDO))
JTRST: J1.03 U1.90(PB4(JTRST))
NRST: J1.15 J9.1 U1.14(NRST)
P/G: J10.2 U1.99(PDR_ON)
PA0: J11.1 U1.23(PA0)
PC104 3V3: J2.24(CS(3.3V)) ; port PC104_3V3
RCC_OSC32_in: R1.2 U1.8(PC14(RCC_OSC32_IN))
RCC_OSC32_out: R3.2 U1.9(PC15(RCC_OSC32_OUT))
RCC_OSC_IN: R4.2 U1.12(PH0(RCC_OSC_IN))
RCC_OSC_OUT: R5.2 U1.13(PH1(RCC_OSC_OUT))
SWCLK: J1.09 U1.76(PA14(SWCLK))
SWDIO: J1.07 U1.72(PA13(SWDIO))
UART5_RX: J2.50(UART_2) U1.83(PD2(uart5_rx))
UART5_TX: J2.52(UART_2) U1.80(PC12(uart5_tx))
Y-CS: J2.13(Y-CS) U2.5(Y)
Z-CS: J2.14(Z-CS) U2.6(Z)
NetC1_2: C1.2 R1.1 X1.4
NetC2_2: C2.2 R3.1 X1.1
NetC3_2: C3.2 R4.1 X2.2
NetC4_1: C4.1 J9.2 R2.1 S1.1 S1.2 S1.3
NetC5_2: C5.2 R5.1 X2.1
NetC7_1: C7.1 C8.1 R14.1 U1.21(VREF+)
NetC9_1: C9.1 U1.73(VCAP2)
NetC10_1: C10.1 U1.49(VCAP1)
NetC11_1: C11.1 C12.2 L1.1 R14.2 U1.22(VDDA)
NetC19_1: C19.1 R16.1 U1.6(VBAT)
NetC22_1: U1.24(PA1_(ADC_IN1)) ; port TEMP2
NetC24_1: U1.25(PA2_(ADC_IN2)) ; port TEMP3
NetC34_1: U1.17(PC2(ADC_IN12)) ; port TEMP1
NetC71_1: C71.1 R38.2
NetC71_2: C71.2 R37.1 R39.1 S2.4 S2.5 S2.6
NetJ1_11: J1.11 R7.1
NetJ1_17: J1.17 R10.1
NetJ1_19: J1.19 R9.1
NetJ3_1: J3.1 R17.2
NetJ7_1: J7.1 R34.2
NetJ11_2: J11.2 R37.2
NetLED1_1: LED1.1 R6.2
NetLED2_1: LED2.1 R8.2
NetLED3_1: LED3.1 R11.2
NetLED4_1: LED4.1 R13.2
NetR6_1: R6.1 U1.59(PD12)
NetR8_1: R8.1 U1.60(PD13)
NetR11_1: R11.1 U1.61(PD14)
NetR13_1: R13.1 U1.62(PD15)
NetU1_1: U1.1(PE2) ; port RF1-C
NetU1_2: U1.2(PE3) ; port RF2-C
NetU1_26: U1.26(PA3(ADC_IN3)) ; port Current
NetU1_29: U1.29(PA4(spi_nss)) ; port SPI1-NSS
NetU1_30: U1.30(PA5(spi_sck)) ; port SPI1-SCK
NetU1_31: U1.31(PA6(spi_miso)) ; port SPI1-MISO
NetU1_32: U1.32(PA7(spi_mosi)) ; port SPI1-MOSI
NetU1_38: U1.38(PE7) ; port HPA-EN
NetU1_78: U1.78(PC10(uart4_tx)) U2.3(DI)
NetU1_79: U1.79(PC11(uart4_rx)) U2.2(RO)

Not connected (* = marked no-connect by the designer): J2 01(A-EPS)* 02(B-EPS)* 03(Y-EPS)* 04(Z-EPS)* 07* 08(5_V)* 09* 10(3.3_V)* 15* 16(GND)* 17(V_bat)* 18(OBC_(3.3V))* 20(ADCS-MT(3.3V))* 21* 22(ADCS(5V)* 23* 25(A-CAM)* 26(Exp(5_V))* 27(B-CAM)* 28(CAMERA_(5V))* 33* 34* 35* 36* 37* 38* 39(A-ADCS)* 40(B-ADCS)* 41* 42(Y-ADCS)* 43* 44(Z-ADCS)* 47* 48* 49* 51(HRes_CS)*; U1 3(PE4)* 4(PE5)* 5(PE6)* 7(PC13)* 15(PC0)* 16(PC1)* 18(PC3)* 33(PC4)* 34(PC5)* 35(PB0)* 36(PB1)* 39(PE8)* 40(PE9)* 41(PE10)* 42(PE11)* 43(PE12)* 44(PE13)* 45(PE14)* 46(PE15)* 47(PB10)* 48(PB11)* 51(PB12)* 52(PB13)* 53(PB14)* 54(PB15)* 55(PD8)* 56(PD9)* 57(PD10)* 58(PD11)* 63(PC6)* 64(PC7)* 65(PC8)* 66(PC9)* 67(PA8)* 68(PA9)* 69(PA10)* 70(PA11)* 71(PA12)* 81(PD0)* 82(PD1)* 84(PD3)* 85(PD4)* 86(PD5)* 87(PD6)* 88(PD7)* 91(PB5)* 92(PB6)* 93(PB7)* 95(PB8)* 96(PB9)* 97(PE0)* 98(PE1)*; X1 2(GND)* 3(GND)*

### Notes on the sheet
- (near U1) Micro controler connection
- Mohamed Farag Elhafy
- (in symbol STM32F407VGT6_1, part A) Power part
- (in symbol STM32F407VGT6_1, part B) My_Circut_Conections
- (in symbol STM32F407VGT6_1, part C) OBC_Conections
- (in symbol STM32F407VGT6_1, part D) Not_used_part